# Altium schematic sheet Control_Display_SD.SchDoc
size A4; SheetNumber: 4; SheetTotal: 5
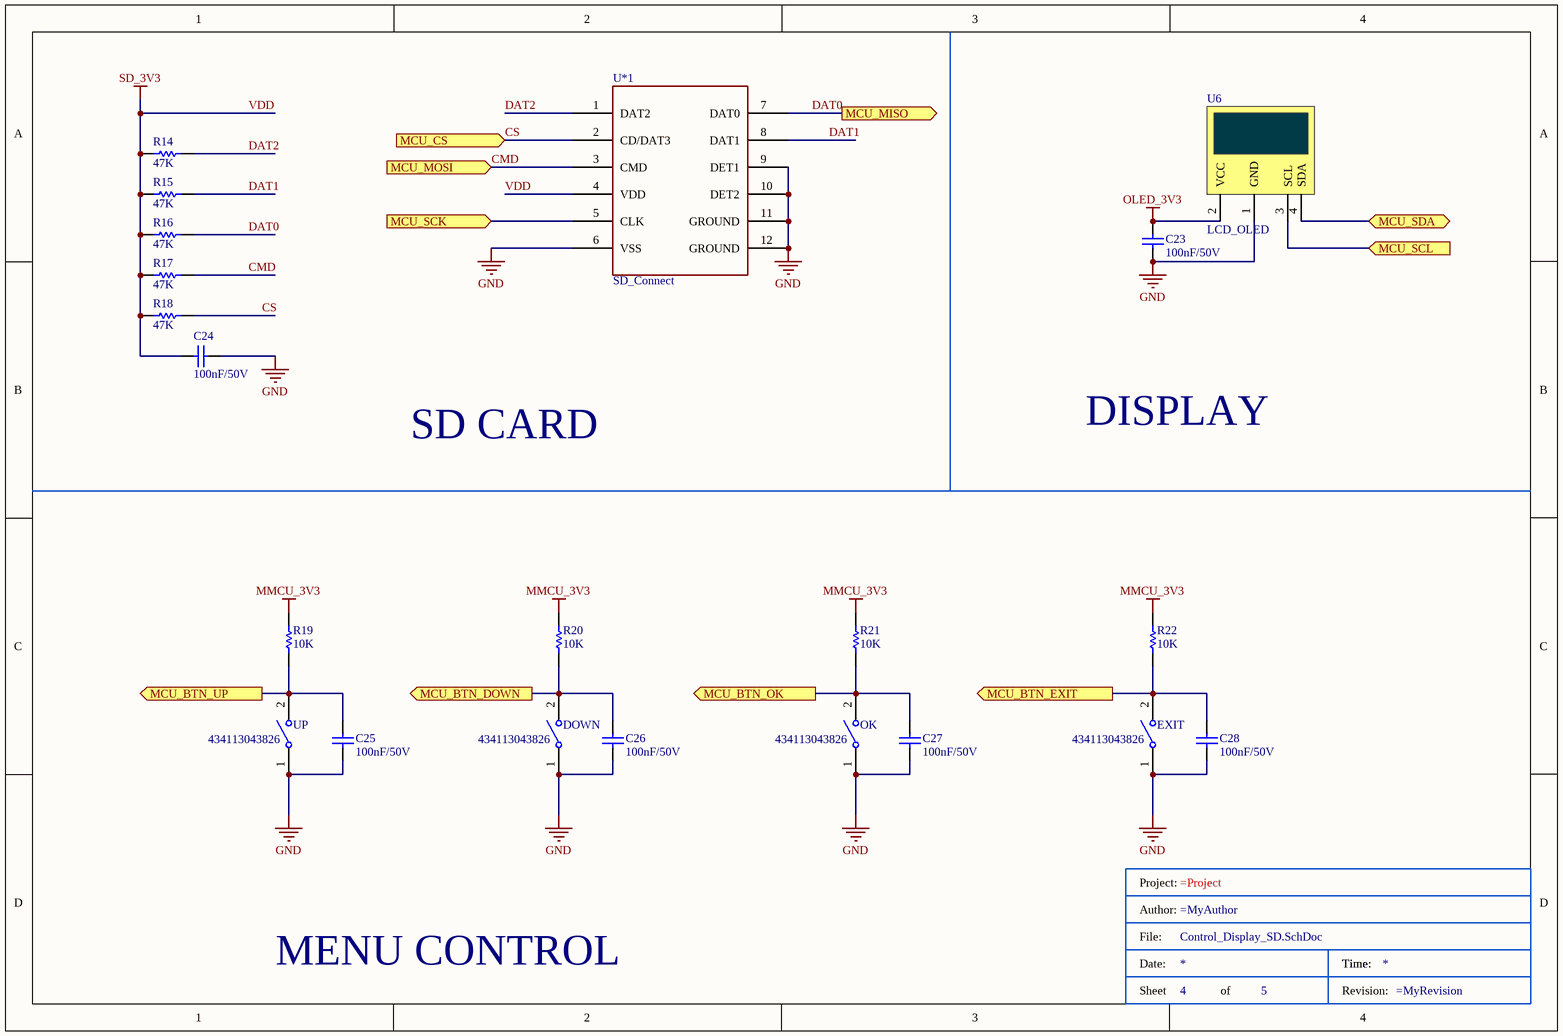
[diagram p0: Control_Display_SD.SchDoc]

## Parts
*  Title Block  (value not drawn)  (graphical)
C23  value 100nF/50V  [CAP-SM-0805]  (hidden comment: Cap-100nF-50V-0805)
C24  value 100nF/50V  [CAP-SM-0805]  (hidden comment: Cap-100nF-50V-0805)
C25  value 100nF/50V  [CAP-SM-0805]  (hidden comment: Cap-100nF-50V-0805)
C26  value 100nF/50V  [CAP-SM-0805]  (hidden comment: Cap-100nF-50V-0805)
C27  value 100nF/50V  [CAP-SM-0805]  (hidden comment: Cap-100nF-50V-0805)
C28  value 100nF/50V  [CAP-SM-0805]  (hidden comment: Cap-100nF-50V-0805)
DOWN  434113043826  [434113043826]
EXIT  434113043826  [434113043826]
OK  434113043826  [434113043826]
R14  value 47K  [RES-SM-0805]  (hidden comment: Res-47K-0805)
R15  value 47K  [RES-SM-0805]  (hidden comment: Res-47K-0805)
R16  value 47K  [RES-SM-0805]  (hidden comment: Res-47K-0805)
R17  value 47K  [RES-SM-0805]  (hidden comment: Res-47K-0805)
R18  value 47K  [RES-SM-0805]  (hidden comment: Res-47K-0805)
R19  value 10K  [RES-SM-0805]  (hidden comment: Res-10k-0805)
R20  value 10K  [RES-SM-0805]  (hidden comment: Res-10k-0805)
R21  value 10K  [RES-SM-0805]  (hidden comment: Res-10k-0805)
R22  value 10K  [RES-SM-0805]  (hidden comment: Res-10k-0805)
U6  LCD_OLED  [LCD_OLED]
U*1  SD_Connect  [SD_CONNECT]
UP  434113043826  [434113043826]

## Ports
MCU_BTN_DOWN (out), MCU_BTN_EXIT (out), MCU_BTN_OK (out), MCU_BTN_UP (out), MCU_CS (in), MCU_MISO (out), MCU_MOSI (in), MCU_SCK (in), MCU_SCL (in), MCU_SDA (bidir)

## Nets
GND: C23.1 C24.2 C25.1 C26.1 C27.1 C28.1 DOWN.1 EXIT.1 OK.1 U6.1(GND) U*1.6(VSS) U*1.9(DET1) U*1.10(DET2) U*1.11(GROUND) U*1.12(GROUND) UP.1
MMCU_3V3: R19.2 R20.2 R21.2 R22.2
OLED_3V3: C23.2 U6.2(VCC)
VDD: C24.1 R14.2 R15.2 R16.2 R17.2 R18.2 U*1.4(VDD)  [also labelled SD_3V3]
CMD: R17.1 U*1.3(CMD) ; port MCU_MOSI
CS: R18.1 U*1.2(CD/DAT3) ; port MCU_CS
DAT0: R16.1 U*1.7(DAT0) ; port MCU_MISO
DAT1: R15.1 U*1.8(DAT1)
DAT2: R14.1 U*1.1(DAT2)
MCU_BTN_DOWN: C26.2 DOWN.2 R20.1 ; port MCU_BTN_DOWN
MCU_BTN_EXIT: C28.2 EXIT.2 R22.1 ; port MCU_BTN_EXIT
MCU_BTN_OK: C27.2 OK.2 R21.1 ; port MCU_BTN_OK
MCU_BTN_UP: C25.2 R19.1 UP.2 ; port MCU_BTN_UP
MCU_SCK: U*1.5(CLK) ; port MCU_SCK
MCU_SCL: U6.3(SCL) ; port MCU_SCL
MCU_SDA: U6.4(SDA) ; port MCU_SDA

## Notes on the sheet
- SD CARD
- DISPLAY
- MENU CONTROL
- (in symbol Title Block) Project:; Author:; File:; Date:; Time:; Sheet; of; Revision:

## Library data of the parts
C23-C28 = Cap-100nF-50V-0805: CAP CER 0.1UF 50V Y5V 0805; Manufacturer: Samsung Electro-Mechanics; Manufacturer Part Number: CL21F104ZBCNNNC; Local Supplier: thegioiic; Local Supplier Link: https://www.thegioiic.com/products/tu-gom-0805-100nf-0-1uf-50v; Supplier 1: Digikey; Supplier 1 Part Number: 1276-1007-1-ND; Supplier 1 Link: https://www.digikey.com/product-detail/en/samsung-electro-mechanics/CL21F104ZBCNNNC/1276-1007-1-ND/3889093
DOWN EXIT OK UP = 434113043826: WS-TASV J-Bend SMT Tact Switch 6x3.5mm, height 4.3mm, 260gf; Rated Voltage: 12VDC; Rated Current: 50mA; Washable: No; ComponentLink1Description: Manufacturer; ComponentLink1URL: http://www.we-online.de; ComponentLink2Description: Datasheet; ComponentLink2URL: https://katalog.we-online.com/em/datasheet/434113043826.pdf; Operating Temperature: -40 to +85degC; Part Number: 434113043826; Published Date: September 2019; Contact Material: Stainless Steel; Height: 4.3mm; Mounting Technology: SMT; Contact Plating: Silver; Operation Force: 260gf; Packaging: Tape and Reel; Terminal Material: Copper Alloy; Publisher: Wurth Elektronik; Terminal Plating: Silver; Local Supplier: thegioiic; Local Supplier Link: https://www.thegioiic.com/products/nut-nhan-3-5x6mm-cao-5mm-2-chan-smd-dau-trang; Local Supplier Part Number: x
R14-R18 = Res-47K-0805: RES SMD 47K OHM 1% 1/8W 0805; Manufacturer: Yageo; Manufacturer Part Number: RC0805FR-0747KL; Local Supplier: thegioiic; Local Supplier Link: https://thegioiic.com/products/dien-tro-47k-ohm-0603-5; Supplier 1: Digikey; Supplier 1 Part Number: 311-47.0KCRCT-ND; Supplier 1 Link: https://www.digikey.com/product-detail/en/yageo/RC0805FR-0747KL/311-47.0KCRCT-ND/730920
R19-R22 = Res-10k-0805: RES 10K OHM 1% 1/4W 0805; Manufacturer: Stackpole Electronics Inc; Manufacturer Part Number: RNCP0805FTD10K0; Local Supplier: thegioiic; Local Supplier Link: https://www.thegioiic.com/products/dien-tro-10-kohm-0805-5; Supplier 1: Digikey; Supplier 1 Link: https://www.digikey.com/product-detail/en/stackpole-electronics-inc/RNCP0805FTD10K0/RNCP0805FTD10K0CT-ND/2240601; Supplier 1 Part Number: RNCP0805FTD10K0CT-ND
U*1 = SD_Connect: 8 pin, PUSH-PUSH